# EAGLE design Temperature_cube_NEO_V2 (EAGLE 7.7.0)

## Sheet 1 of 2
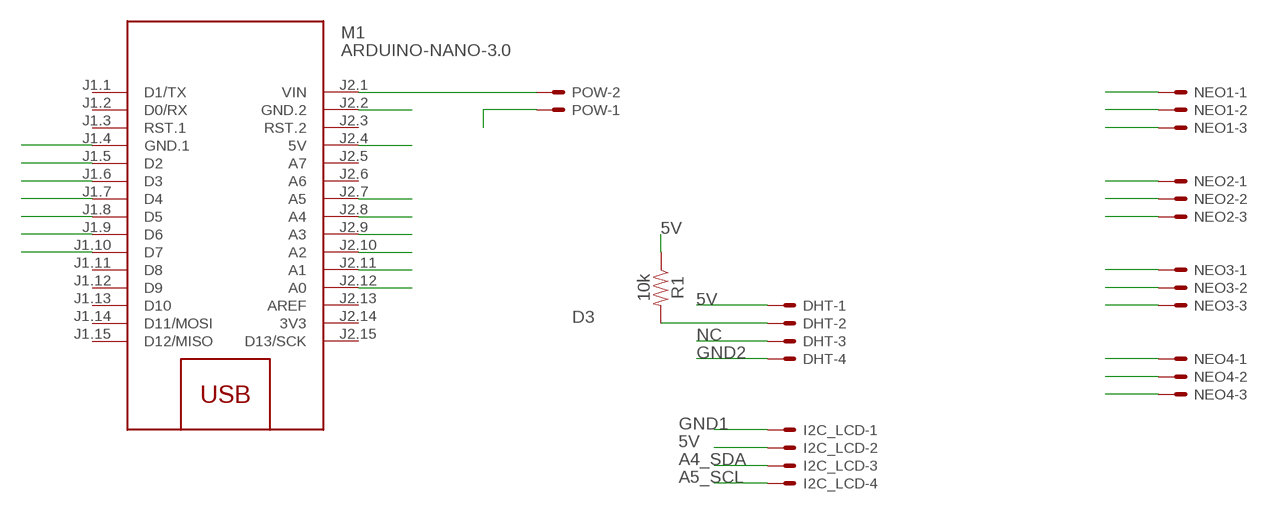
[diagram p0: schematic, sheet 1]

### Parts
DHT  JST-XH-04-PIN-ROUND-PAD  [JST-XH-04-PACKAGE-ROUND-PAD]
I2C_LCD  JST-XH-04-PIN-ROUND-PAD  [JST-XH-04-PACKAGE-ROUND-PAD]
M1  ARDUINO-NANO-3.0  [ARDUINO-NANO-3.0]
NEO1  JST-XH-03-PIN-ROUND-PAD  [JST-XH-03-PACKAGE-ROUND-PAD]
NEO2  JST-XH-03-PIN-ROUND-PAD  [JST-XH-03-PACKAGE-ROUND-PAD]
NEO3  JST-XH-03-PIN-ROUND-PAD  [JST-XH-03-PACKAGE-ROUND-PAD]
NEO4  JST-XH-03-PIN-ROUND-PAD  [JST-XH-03-PACKAGE-ROUND-PAD]
POW  JST-XH-02-PIN-ROUND-PAD  [JST-XH-02-PACKAGE-ROUND-PAD]
R1  10k  1KOHM-HORIZ-1/4W-1%  [AXIAL-0.3]

### Nets
5V: DHT.1 I2C_LCD.2 M1.J2.4(5V) NEO1.1 NEO2.1 NEO3.1 NEO4.1 R1.P$1
A0: M1.J2.12(A0) NEO1.2
A1: M1.J2.11(A1) NEO2.2
A2: M1.J2.10(A2) NEO3.2
A3: M1.J2.9(A3) NEO4.2
A4_SDA: I2C_LCD.3 M1.J2.8(A4)
A5_SCL: I2C_LCD.4 M1.J2.7(A5)
D2: M1.J1.5(D2)
D3: DHT.2 M1.J1.6(D3) R1.P$2
D4: M1.J1.7(D4)
D5: M1.J1.8(D5)
D6: M1.J1.9(D6)
D7: M1.J1.10(D7)
GND1: I2C_LCD.1 M1.J1.4(GND.1) NEO3.3 NEO4.3
GND2: DHT.4 M1.J2.2(GND.2) NEO1.3 NEO2.3 POW.1
NC: DHT.3
POW: M1.J2.1(VIN) POW.2
Unconnected: M1.J1.1(D1/TX) M1.J1.2(D0/RX) M1.J1.3(RST.1) M1.J1.11(D8) M1.J1.12(D9) M1.J1.13(D10) M1.J1.14(D11/MOSI) M1.J1.15(D12/MISO) M1.J2.3(RST.2) M1.J2.5(A7) M1.J2.6(A6) M1.J2.13(AREF) M1.J2.15(D13/SCK)

## Sheet 2 of 2

## Power pins joined to a net without a drawn wire
3V3: M1.J2.14(3V3)

## Library data of the parts
DHT I2C_LCD = Rembrandt Electronics - JST XH Connectors v1-0:JST-XH-04-PIN: JST XH Connector 2 Pin Wire to board connector. Pitch: 2,54 mm, (0.100") Number of pins: 4 Created by Rembrandt Electronics www.rembrandtelectronics.com
M1 = diy-modules:ARDUINO-NANO-3.0: Arduino Nano 3.0 and compatible devices More details available here: https://www.arduino.cc/en/Main/ArduinoBoardNano Click here to find device on ebay.com <http://www.ebay.com/sch/arduino+nano>
NEO1-NEO4 = Rembrandt Electronics - JST XH Connectors v1-0:JST-XH-03-PIN: JST XH Connector 2 Pin Wire to board connector. Pitch: 2,54 mm, (0.100") Number of pins: 3 Created by Rembrandt Electronics www.rembrandtelectronics.com
POW = Rembrandt Electronics - JST XH Connectors v1-0:JST-XH-02-PIN: JST XH Connector 2 Pin Wire to board connector. Pitch: 2,54 mm, (0.100") Number of pins: 2 Created by Rembrandt Electronics www.rembrandtelectronics.com
R1 = SparkFun-Resistors:1KOHM: 1kΩ resistor A resistor is a passive two-terminal electrical component that implements electrical resistance as a circuit element. Resistors act to reduce current flow, and, at the same time, act to lower voltage levels within circuits. - Wikipedia; PROD_ID: RES-12182; VALUE: 1k

## Board
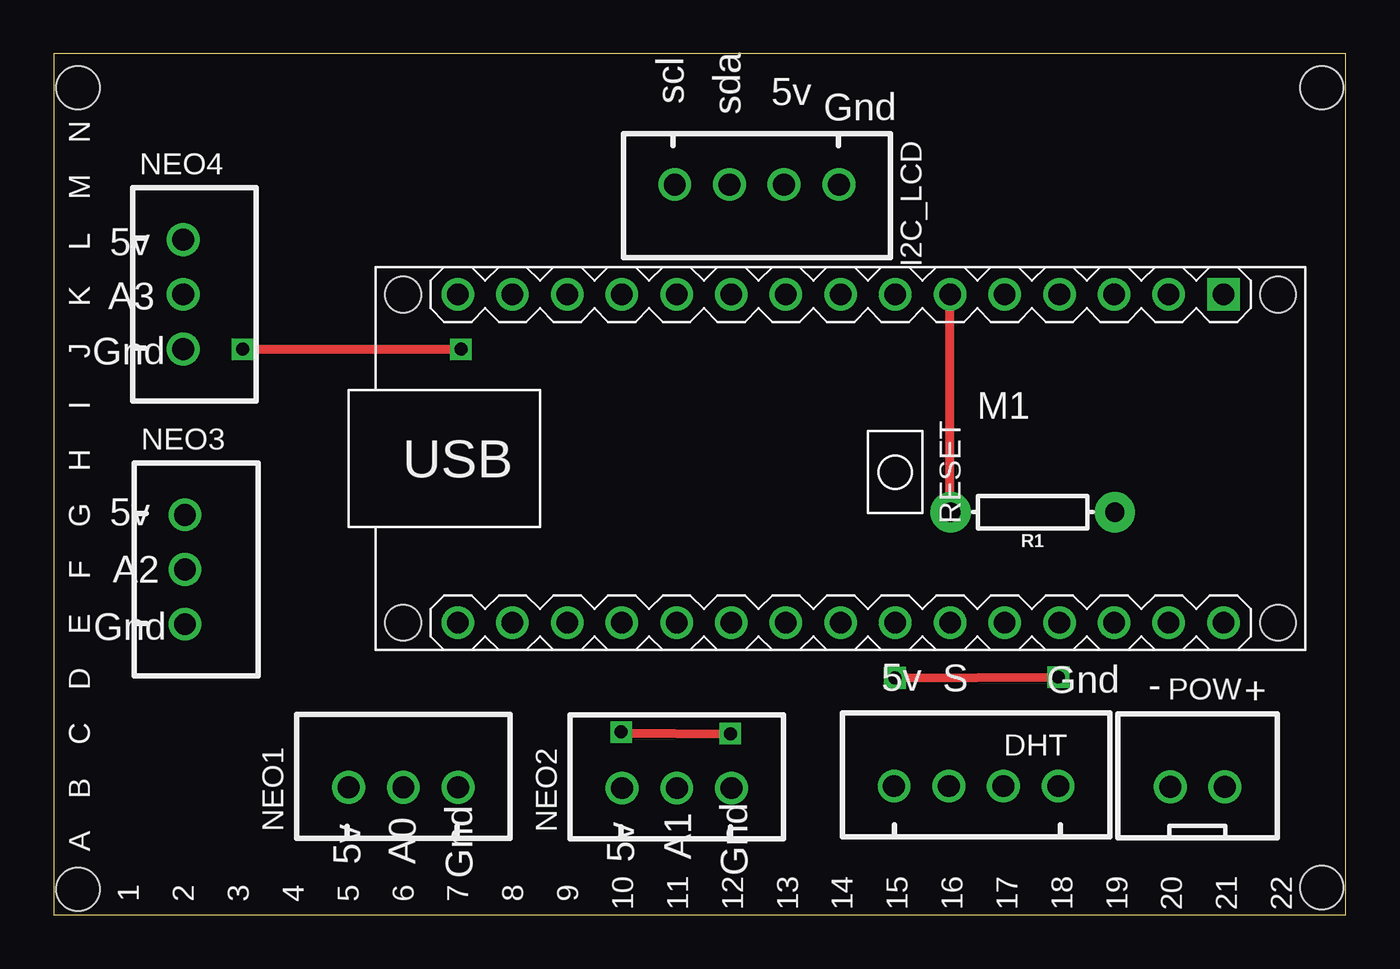
[diagram p1: board, top side]
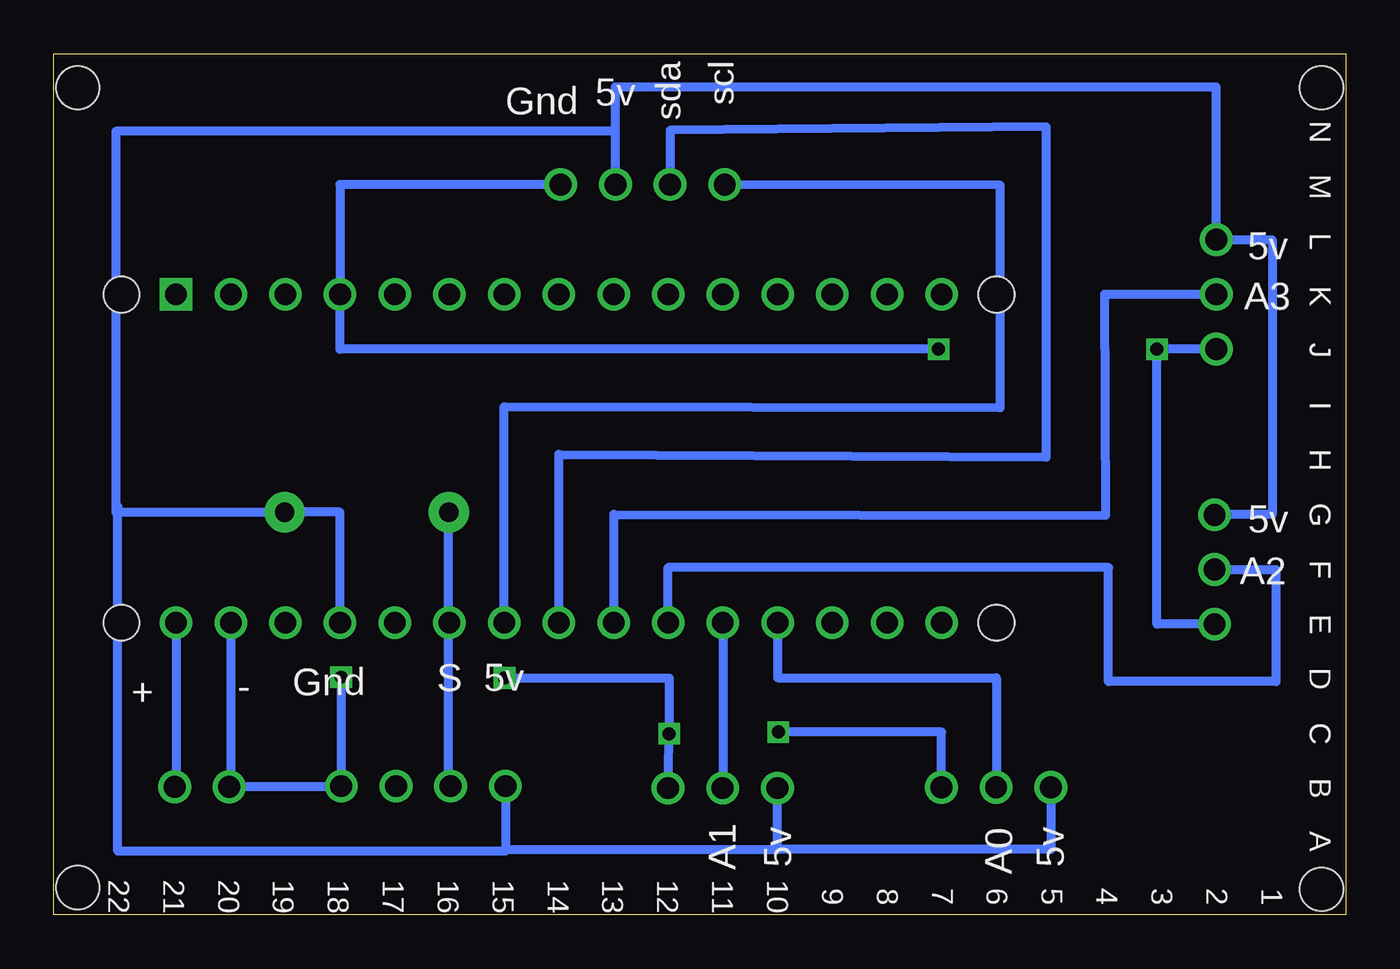
[diagram p2: board, bottom side, seen from below]

Size 60 x 40 mm. Coordinates in mm from the lower left corner, seen from the top.
Outline: 0,0 60,0 60,40 0,40 0,0
Copper layers (1*16): Top 0.035mm / dielectric 1.5mm / Bottom 0.035mm
Design rules "default": minimum track width 10mil, minimum drill 24mil, track to track 8mil, track to pad 8mil, pad to pad 8mil, via to via 8mil, smd to smd 8mil, copper to edge 40mil, drill to drill 8mil, minimum pad ring 10mil, minimum via ring 8mil, stop-mask expansion 4mil, vias tented up to drill 0mil, thermal gap 10mil
Holes 2 mm at 58.89,1.27 58.89,38.43 1.12,1.19 1.12,38.43

### Footprints (pad centres in the part's own frame; a part is rotated, then mirrored left to right if it is on the bottom)
JST-XH-04-PACKAGE-ROUND-PAD = drill 1.016: 1 -3.81,0; 2 -1.27,0; 3 1.27,0; 4 3.81,0
ARDUINO-NANO-3.0 = drill 1 square: J1.1 17.78,7.62 | drill 1: J1.2 15.24,7.62; J1.3 12.7,7.62; J1.4 10.16,7.62; J1.5 7.62,7.62; J1.6 5.08,7.62; J1.7 2.54,7.62; J1.8 0,7.62; J1.9 -2.54,7.62; J1.10 -5.08,7.62; J1.11 -7.62,7.62; J1.12 -10.16,7.62; J1.13 -12.7,7.62; J1.14 -15.24,7.62; J1.15 -17.78,7.62; J2.1 17.78,-7.62; J2.2 15.24,-7.62; J2.3 12.7,-7.62; J2.4 10.16,-7.62; J2.5 7.62,-7.62; J2.6 5.08,-7.62; J2.7 2.54,-7.62; J2.8 0,-7.62; J2.9 -2.54,-7.62; J2.10 -5.08,-7.62; J2.11 -7.62,-7.62; J2.12 -10.16,-7.62; J2.13 -12.7,-7.62; J2.14 -15.24,-7.62; J2.15 -17.78,-7.62 | hole 1.651: -20.32,7.62; -20.32,-7.62; 20.32,-7.62; 20.32,7.62
JST-XH-03-PACKAGE-ROUND-PAD = drill 1.016: 1 -2.54,0; 2 0,0; 3 2.54,0
JST-XH-02-PACKAGE-ROUND-PAD = drill 1.016: 1 -1.27,0; 2 1.27,0
AXIAL-0.3 = drill 0.9 pad 1.88: P$1 -3.81,0; P$2 3.81,0

### Placement (x,y rotation side)
DHT  42.84,5.98 0 top
I2C_LCD  32.65,33.93 180 top
M1  36.54,21.2 0 top
NEO1  16.23,5.92 0 top
NEO2  28.94,5.89 0 top
NEO3  6.09,16.05 270 top
NEO4  6.01,28.83 270 top
POW  53.12,5.94 0 top
R1  45.47,18.71 180 top
U$1  [1X14]  3.54,19.86 90 top
U$2  [1X14]  6.08,19.86 90 top
U$3  [1X14]  8.62,19.86 90 top
U$4  [1X14]  11.16,19.86 90 top
U$5  [1X14]  13.7,19.86 90 top
U$6  [1X14]  16.24,19.86 90 top
U$7  [1X14]  18.78,19.86 90 top
U$8  [1X14]  21.32,19.86 90 top
U$9  [1X14]  23.86,19.86 90 top
U$10  [1X14]  26.4,19.86 90 top
U$11  [1X14]  28.94,19.86 90 top
U$12  [1X14]  31.48,19.86 90 top
U$13  [1X14]  34.02,19.86 90 top
U$14  [1X14]  36.56,19.86 90 top
U$15  [1X14]  39.1,19.86 90 top
U$16  [1X14]  41.64,19.86 90 top
U$17  [1X14]  44.18,19.86 90 top
U$18  [1X14]  46.72,19.86 90 top
U$19  [1X14]  49.26,19.86 90 top
U$20  [1X14]  51.8,19.86 90 top
U$21  [1X14]  54.34,19.86 90 top
U$22  [1X14]  56.88,19.86 90 top

### Tracks (layer width: path | path; a pad name or v marks a point on that pad's centre or on a via)
5V
  Bottom 0.406: M1.J2.4 46.7,18.71 R1.P$1 57.12,18.71 57.12,18.97 | I2C_LCD.2 33.92,36.4 33.93,36.4 | 33.93,36.4 57.12,36.4 57.12,18.97 | 57.12,18.97 57.02,18.97 57.02,2.96 39.03,2.96 DHT.1 39.03,3.04 26.38,3.04 | 33.93,36.4 33.93,38.45 6.01,38.45 NEO4.1 3.42,31.37 3.42,18.59 NEO3.1 | 26.38,3.04 26.38,5.89 NEO2.1 | NEO1.1 13.69,3.04 26.38,3.04
A0
  Bottom 0.406: 26.36,13.58 M1.J2.12 26.38,11.01 16.23,11.01 NEO1.2
A1
  Bottom 0.406: 28.9,13.58 M1.J2.11 28.92,5.89 NEO2.2
A2
  Bottom 0.406: 31.44,13.58 M1.J2.10 31.46,16.13 11.02,16.13 11.02,10.84 3.25,10.84 3.25,16.05 NEO3.2
A3
  Bottom 0.406: M1.J2.9 33.98,13.58 33.98,18.61 11.15,18.57 11.19,28.83 NEO4.2
A4_SDA
  Bottom 0.406: M1.J2.8 36.54,21.39 13.91,21.27 13.91,36.61 31.38,36.44 I2C_LCD.3 | I2C_LCD.3
A5_SCL
  Bottom 0.406: M1.J2.7 39.08,23.61 16.04,23.57 16.04,33.89 I2C_LCD.4
D3
  Top 0.406: R1.P$2 41.62,18.71 M1.J1.6
  Bottom 0.406: 41.62,5.98 DHT.2 41.66,5.98 R1.P$2
GND1  (via drill 0.6)
  Top 0.406: v8.76,26.28 v18.91,26.28
  Bottom 0.406: I2C_LCD.1 46.7,33.93 M1.J1.4 46.7,26.28 v18.91,26.28 | NEO4.3 v8.76,26.29 v8.76,26.28 8.76,13.51 NEO3.3
GND2  (via drill 0.6)
  Top 0.406: v26.35,8.49 26.35,8.45 v31.42,8.42 | v39.07,11.01 39.13,11.01 v46.66,11.05
  Bottom 0.406: 51.77,13.58 M1.J2.2 51.78,5.95 POW.1 46.65,5.95 DHT.4 | NEO1.3 18.77,8.49 v26.35,8.49 | 46.58,5.98 DHT.4 | v46.66,11.05 DHT.4 | v39.07,11.01 31.42,11.01 v31.42,8.42 31.43,8.05 NEO2.3 31.48,5.85
POW
  Bottom 0.406: 54.31,13.58 M1.J2.1 54.32,5.95 POW.2

### Text on the board
tNames: scl | 5v | sda | Gnd | N | M | L | 5v | K | A3 | J | Gnd | I | H | G | 5v | F | A2 | E | Gnd | D | 5v | S | Gnd | - | + | C | B | A | A1 | 5v | A0 | Gnd | 5v | Gnd | 1 / 2 / 3 / 4 / 5 / 6 / 7 / 8 / 9 / 10 / 11 / 12 / 13 / 14 / 15 / 16 / 17 / 18 / 19 / 20 / 21 / 22
bNames: scl | sda | 5v | Gnd | N | M | 5v | L | K | A3 | J | I | H | G | 5v | A2 | F | E | D | 5v | S | Gnd | - | + | C | B | 5v | A0 | 5v | A1 | A | 1 / 2 / 3 / 4 / 5 / 6 / 7 / 8 / 9 / 10 / 11 / 12 / 13 / 14 / 15 / 16 / 17 / 18 / 19 / 20 / 21 / 22